# Altium schematic sheet DAC_AFE.SchDoc: DAC AFE
size 420 x 297 mm; Author: P. Zdunek; DrawnBy: P. Zdunek; Organization: WUT ISE; Address1: L3, 12a Rodborough Rd; Address2: Frenchs Forest; Address3: NSW; Address4: Australia 2086; DocumentNumber: 7; SheetNumber: 7; SheetTotal: 37; ModifiedBy: -; CheckedDate: -; Title2: Fast Stabilizer; DivGrp: WUT ISE; Designer: G.Kasprowicz
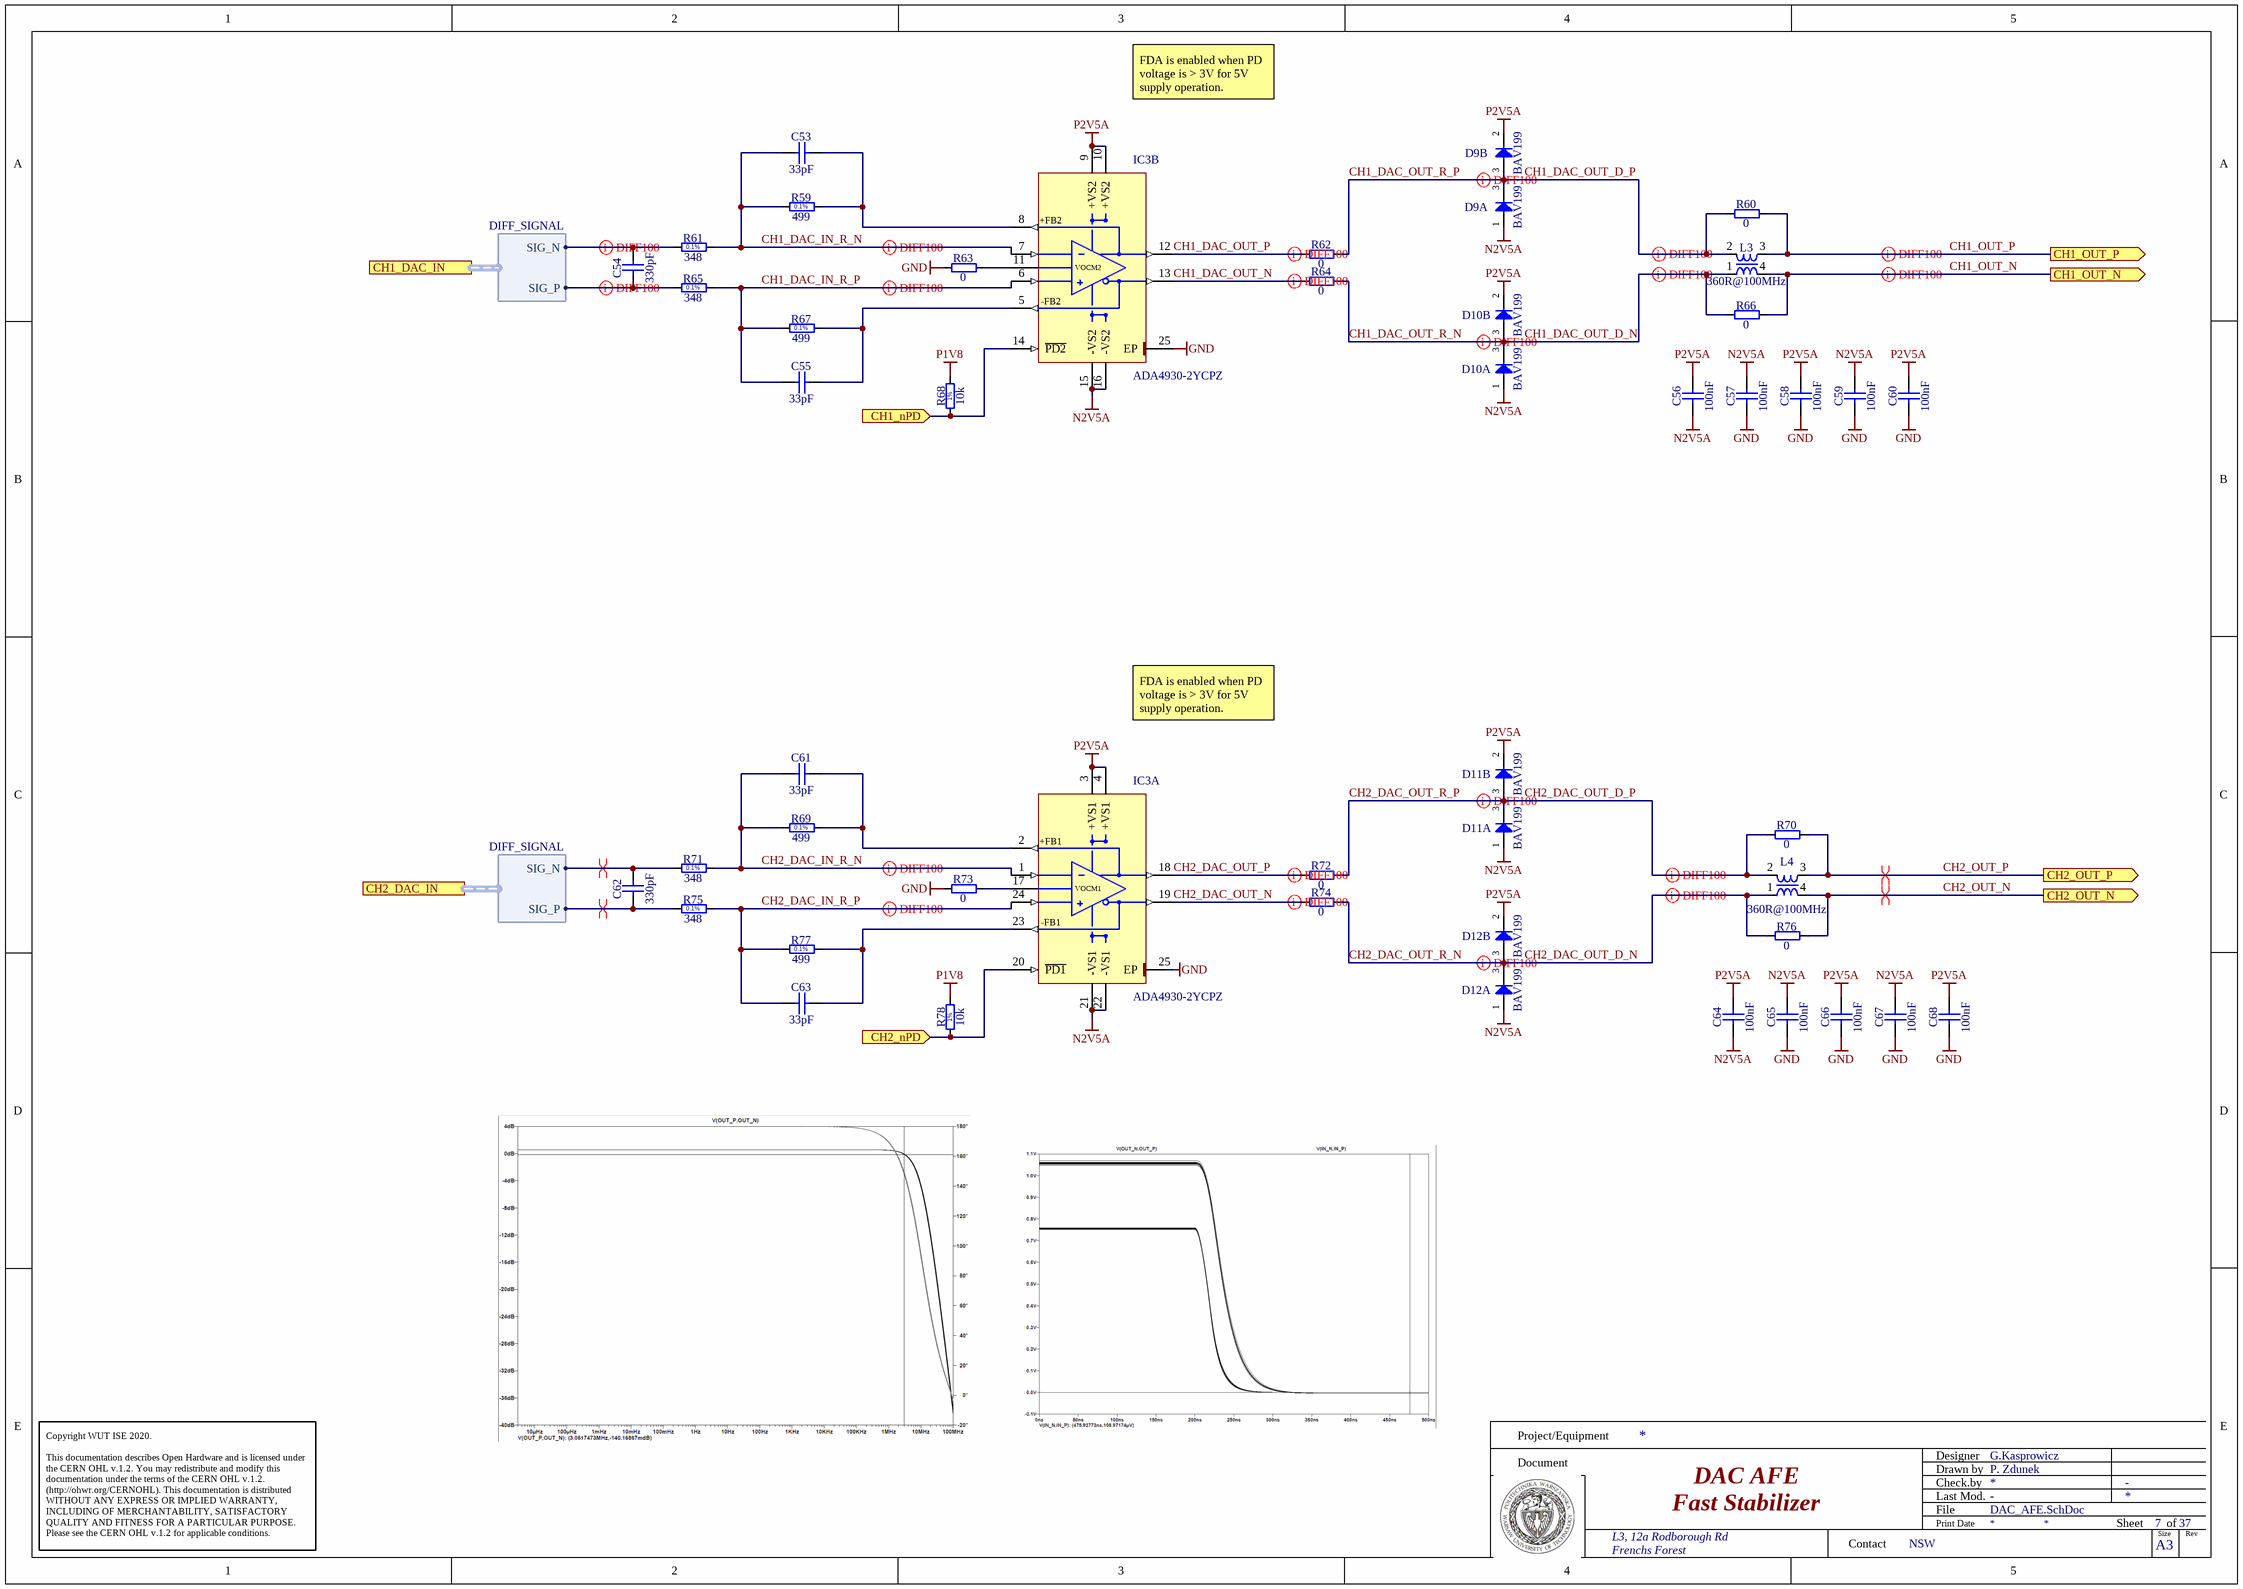
[diagram p0: DAC_AFE.SchDoc]

## Parts
C53  33pF  [CAPC1608X87N]
C54  330pF  [CAPC1608X87N]
C55  33pF  [CAPC1608X87N]
C56  100nF  [CAPC1005X55N]
C57  100nF  [CAPC1005X55N]
C58  100nF  [CAPC1005X55N]
C59  100nF  [CAPC1005X55N]
C60  100nF  [CAPC1005X55N]
C61  33pF  [CAPC1608X87N]
C62  330pF  [CAPC1608X87N]
C63  33pF  [CAPC1608X87N]
C64  100nF  [CAPC1005X55N]
C65  100nF  [CAPC1005X55N]
C66  100nF  [CAPC1005X55N]
C67  100nF  [CAPC1005X55N]
C68  100nF  [CAPC1005X55N]
D9  BAV199  [SOT95P240X110-3N]  (parts A,B of 2)
D10  BAV199  [SOT95P240X110-3N]  (parts A,B of 2)
D11  BAV199  [SOT95P240X110-3N]  (parts A,B of 2)
D12  BAV199  [SOT95P240X110-3N]  (parts A,B of 2)
IC3  ADA4930-2YCPZ  [QFN50P400X400X80-25N-S240]  (parts A,B of 2)
L3  360R@100MHz  [IND_TDK_ACM2012]
L4  360R@100MHz  [IND_TDK_ACM2012]
R59  499  [RESC1608X55N]
R60  0  [RESC1005X40N]
R61  348  [RESC1608X55N]
R62  0  [RESC1005X40N]
R63  0  [RESC1005X40N]
R64  0  [RESC1005X40N]
R65  348  [RESC1608X55N]
R66  0  [RESC1005X40N]
R67  499  [RESC1608X55N]
R68  10k  [RESC1005X40N]
R69  499  [RESC1608X55N]
R70  0  [RESC1005X40N]
R71  348  [RESC1608X55N]
R72  0  [RESC1005X40N]
R73  0  [RESC1005X40N]
R74  0  [RESC1005X40N]
R75  348  [RESC1608X55N]
R76  0  [RESC1005X40N]
R77  499  [RESC1608X55N]
R78  10k  [RESC1005X40N]

## Ports
CH1_DAC_IN (harness DIFF_SIGNAL), CH1_nPD (in), CH1_OUT_N (out), CH1_OUT_P (out), CH2_DAC_IN (harness DIFF_SIGNAL), CH2_nPD (in), CH2_OUT_N (out), CH2_OUT_P (out)

## Harnesses
DIFF_SIGNAL: SIG_N, SIG_P

## Nets
GND: C57.1 C58.1 C59.1 C60.1 C65.1 C66.1 C67.1 C68.1 IC3.25(EP) R63.1 R73.1
N2V5A: C56.1 C57.2 C59.2 C64.1 C65.2 C67.2 D9.1(A) D10.1(A) D11.1(A) D12.1(A) IC3.15(-VS2) IC3.16(-VS2) IC3.21(-VS1) IC3.22(-VS1)
P1V8: R68.2 R78.2
P2V5A: C56.2 C58.2 C60.2 C64.2 C66.2 C68.2 D9.2(C) D10.2(C) D11.2(C) D12.2(C) IC3.3(+VS1) IC3.4(+VS1) IC3.9(+VS2) IC3.10(+VS2)
CH1_DAC_IN_R_N: C53.1 IC3.7(-IN2) R59.1 R61.2
CH1_DAC_IN_R_P: C55.1 IC3.6(+IN2) R65.2 R67.1
CH1_DAC_OUT_D_N: D10.3(COMAC) L3.1 R64.2 R66.1  [also labelled CH1_DAC_OUT_R_N]
CH1_DAC_OUT_D_P: D9.3(COMAC) L3.2 R60.1 R62.2  [also labelled CH1_DAC_OUT_R_P]
CH1_DAC_OUT_N: IC3.13(-OUT2) R64.1
CH1_DAC_OUT_P: IC3.12(+OUT2) R62.1
CH1_nPD: IC3.14(~{PD2}) R68.1 ; port CH1_nPD
CH1_OUT_N: L3.4 R66.2 ; port CH1_OUT_N
CH1_OUT_P: L3.3 R60.2 ; port CH1_OUT_P
CH2_DAC_IN_R_N: C61.1 IC3.1(-IN1) R69.1 R71.2
CH2_DAC_IN_R_P: C63.1 IC3.24(+IN1) R75.2 R77.1
CH2_DAC_OUT_D_N: D12.3(COMAC) L4.1 R74.2 R76.1  [also labelled CH2_DAC_OUT_R_N]
CH2_DAC_OUT_D_P: D11.3(COMAC) L4.2 R70.1 R72.2  [also labelled CH2_DAC_OUT_R_P]
CH2_DAC_OUT_N: IC3.19(-OUT1) R74.1
CH2_DAC_OUT_P: IC3.18(+OUT1) R72.1
CH2_nPD: IC3.20(~{PD1}) R78.1 ; port CH2_nPD
CH2_OUT_N: L4.4 R76.2 ; port CH2_OUT_N
CH2_OUT_P: L4.3 R70.2 ; port CH2_OUT_P
NetC53_2: C53.2 IC3.8(+FB2) R59.2
NetC54_1: C54.1 R65.1 ; port CH1_DAC_IN.SIG_P
NetC54_2: C54.2 R61.1 ; port CH1_DAC_IN.SIG_N
NetC55_2: C55.2 IC3.5(-FB2) R67.2
NetC61_2: C61.2 IC3.2(+FB1) R69.2
NetC62_1: C62.1 R75.1 ; port CH2_DAC_IN.SIG_P
NetC62_2: C62.2 R71.1 ; port CH2_DAC_IN.SIG_N
NetC63_2: C63.2 IC3.23(-FB1) R77.2
NetIC3_11: IC3.11(VOCM2) R63.2
NetIC3_17: IC3.17(VOCM1) R73.2

## Layout directives
differential pair: CH1_DAC_IN_R_N, CH1_DAC_IN_R_P, CH1_DAC_OUT_D_N, CH1_DAC_OUT_D_P, CH1_DAC_OUT_N, CH1_DAC_OUT_P, CH1_OUT_N, CH1_OUT_P, CH2_DAC_IN_R_N, CH2_DAC_IN_R_P, CH2_DAC_OUT_D_N, CH2_DAC_OUT_D_P, CH2_DAC_OUT_N, CH2_DAC_OUT_P, CH2_OUT_N, CH2_OUT_P, NetC54_1, NetC54_2, NetC62_1, NetC62_2

## Notes on the sheet
- FDA is enabled when PD voltage is > 3V for 5V supply operation.
- Project/Equipment
- Document
- Designer
- Drawn by
- Check.by
- Copyright WUT ISE 2020.
  This documentation describes Open Hardware and is licensed under the CERN OHL v.1.2. You may redistribute and modify this documentation under the terms of the CERN OHL v.1.2. (http://ohwr.org/CERNOHL). This documentation is distributed WITHOUT ANY EXPRESS OR IMPLIED WARRANTY, INCLUDING OF MERCHANTABILITY, SATISFACTORY QUALITY AND FITNESS FOR A PARTICULAR PURPOSE. Please see the CERN OHL v.1.2 for applicable conditions.
- Contact
- File
- Last Mod.
- Print Date
- Sheet
- Size
- A3
- of
- Rev
- (in symbol R0402_10K_1%_0.0625W_100PPM) 1%
- (in symbol R0603_348R_0.1%_0.063W_10PPM) 0.1%
- (in symbol R0603_499R_0.1%_0.063W_10PPM) 0.1%

## Library data of the parts
C53 C55 C61 C63 = CC0603_33PF_50V_5%_NP0: Non-polarised capacitor; Part Description: SMD Multilayer Chip Ceramic Capacitor; Manufacturer: GENERIC; Manufacturer1 Part Number: 223886715339; Voltage: 50V; TC: C0G/NP0; Tolerance: ±5%; Part Number: CC0603_33PF_50V_5%_NP0; Component Kind: Standard; Component Type: Standard; Pin Count: 2; Value: 33pF; Status: Preferred; Manufacturer Part Number: CC0603_33PF_50V_5%_NP0; Case: 0603; Mounted: Yes; Socket: No; SMD: Yes; Sense: No; Manufacturer1 Example: PHYCOMP; Manufacturer1 ComponentHeight: 0.87mm; HelpURL: \\cern.ch\dfs\Applications\Altium\Datasheets\CC0603_NP0_PHYCOMP.pdf; Author: CERN DEM JLC; CreateDate: 03-Dec-07; LatestRevisionDate: 03-Dec-07
C54 C62 = CC0603_330PF_50V_1%_NP0: Non-polarised capacitor; Part Description: SMD Multilayer Chip Ceramic Capacitor; Manufacturer: GENERIC; Manufacturer1 Part Number: 223886718331; Voltage: 50V; TC: C0G/NP0; Tolerance: ±1%; Part Number: CC0603_330PF_50V_1%_NP0; Component Kind: Standard; Component Type: Standard; Pin Count: 2; Value: 330pF; Status: None; Manufacturer Part Number: CC0603_330PF_50V_1%_NP0; Case: 0603; Mounted: Yes; Socket: No; SMD: Yes; Sense: No; Manufacturer1 Example: PHYCOMP; Manufacturer1 ComponentHeight: 0.87mm; HelpURL: \\cern.ch\dfs\Applications\Altium\Datasheets\CC0603_NP0_PHYCOMP.pdf; Author: CERN DEM MR; CreateDate: 06.09.2017; LatestRevisionDate: 06.09.2017
C56-C60 C64-C68 = CC0402_100NF_16V_10%_X7R: Non-polarised capacitor; Part Description: SMD Multilayer Chip Ceramic Capacitor; Manufacturer: GENERIC; Manufacturer1 Part Number: GRM155R71C104KA88D; Voltage: 16V; TC: X7R; Tolerance: ±10%; Part Number: CC0402_100NF_16V_10%_X7R; Component Kind: Standard; Component Type: Standard; Pin Count: 2; Value: 100nF; Status: Not Recommended; Manufacturer Part Number: CC0402_100NF_16V_10%_X7R; Case: 0402; Mounted: Yes; Socket: No; SMD: Yes; Sense: No; Manufacturer1 Example: MURATA; Manufacturer1 ComponentHeight: 0.55mm; HelpURL: \\cern.ch\dfs\Applications\Altium\Datasheets\CC0402_X7R_MURATA_GRM.pdf; Author: CERN DEM JLC; CreateDate: 05-Dec-13; LatestRevisionDate: 03-Dec-07
D9-D12 = BAV199: Serial Diode; Part Description: Low-Leakage Double Diode; Manufacturer: NXP SEMICONDUCTORS; Voltage: 75V; Power: 250mW; PressFit: No; Bonding: No; Part Number: BAV199; Component Kind: Standard; Component Type: Standard; Device: BAV199; PackageDescription: SOT23 3-Leads, Pitch 0.95mm - Body 1.4x3mm, IPC Medium Density; Manufacturer Part Number: BAV199; Pin Count: 3; Case: SOT23-3; Mounted: Yes; Socket: No; SMD: Yes; Sense: No; ComponentHeight: 1.1mm; HelpURL: \\cern.ch\dfs\Applications\Altium\Datasheets\BAV199.pdf; Author: CERN DEM JMW; CreateDate: 2008-11-21; LatestRevisionDate: 2008-11-21
IC3 = ADA4930-2YCPZ: Ultralow Noise Drivers For Low Voltage ADCs; Manufacturer: ANALOG DEVICES; PressFit: No; Bonding: No; Part Number: ADA4930-2YCPZ; Component Kind: Standard; Component Type: Standard; Device: ADA4930-2YCPZ; PackageDescription: QFN, 0.50mm Pitch, Square; 24 Pin, 4.00mm L X 4.00mm W X 0.80mm H body (w/Thermal Tab 2.40 X 2.40mm), IPC Medium Density; Part Description: Ultralow Noise Drivers For Low Voltage ADCs; Manufacturer Part Number: ADA4930-2YCPZ; Pin Count: 25; Case: QFN24; Mounted: Yes; Socket: No; SMD: Yes; Sense: No; ComponentHeight: 0.8mm; Author: CERN DEM MR; HelpURL: \\cern.ch\dfs\Applications\Altium\Datasheets\ADA4930-2YCPZ.pdf; CreateDate: 23/11/2016; LatestRevisionDate: 23/11/2016
L3 L4 = IND_TDK_ACM2012-361-2P: Inductor Common Mode; Part Description: Common Mode Filters For High-Speed Differential Signal Line, TDK ACM2012 Series; Manufacturer: TDK; Power: 220mA; Resistance: 0R5; Part Number: IND_TDK_ACM2012-361-2P; Component Kind: Standard; Component Type: Standard; Pin Count: 2; Value: 360R@100MHz; Status: None; Manufacturer Part Number: ACM2012-361-2P; Mounted: Yes; Socket: No; SMD: Yes; Sense: No; ComponentHeight: 1.3mm; HelpURL: \\cern.ch\dfs\Applications\Altium\Datasheets\IND_TDK_ACM2012.pdf; Author: CERN DEM BC; CreateDate: 07/07/2020; LatestRevisionDate: 07/07/2020
R59 R67 R69 R77 = R0603_499R_0.1%_0.063W_10PPM: Resistor - 0.1%; Part Description: Thin Film Chip Resistor; Manufacturer: GENERIC; Manufacturer1 Part Number: RN73C1J499RBTDF; Power: 0.063W; TC: ±10ppm; PressFit: No; Part Number: R0603_499R_0.1%_0.063W_10PPM; Component Kind: Standard; Component Type: Standard; Pin Count: 2; Value: 499; Status: Not Recommended; Tolerance: ±0.1%; Manufacturer Part Number: R0603_499R_0.1%_0.063W_10PPM; Case: 0603; Mounted: Yes; Sense: No; Socket: No; SMD: Yes; Manufacturer1 Example: TYCO HOLSWORTHY; Manufacturer1 ComponentHeight: 0.5mm; HelpURL: \\cern.ch\dfs\Applications\Altium\Datasheets\R0603_Tyco_RN73.pdf; Author: CERN DEM JLC; CreateDate: 03-Dec-07; LatestRevisionDate: 13-Mar-08
R60 R62-R64 R66 R70 R72-R74 R76 = R0402_0R_JUMPER: Resistor; Part Description: 1A (0.05R Max DC Resistance) Zero Ohm Jumper; Manufacturer: GENERIC; Manufacturer1 Part Number: 232270591001L; PressFit: No; Part Number: R0402_0R_JUMPER; Component Kind: Standard; Component Type: Standard; Pin Count: 2; Value: 0; Status: Not Recommended; Manufacturer Part Number: R0402_0R_JUMPER; Case: 0402; Mounted: Yes; Sense: No; Socket: No; SMD: Yes; Manufacturer1 Example: YAGEO PHYCOMP; Manufacturer1 ComponentHeight: 0.4mm; HelpURL: \\cern.ch\dfs\Applications\Altium\Datasheets\R0402_Phycomp_RC0402.pdf; Author: CERN DEM JLC
  R60 R66 R70 R76: CreateDate: 03/12/2007; LatestRevisionDate: 17/10/2012
  R62-R64 R72-R74: CreateDate: 03-Dec-07; LatestRevisionDate: 17-Oct-12
R61 R65 R71 R75 = R0603_348R_0.1%_0.063W_10PPM: Resistor - 0.1%; Part Description: Thin Film Chip Resistor; Manufacturer: GENERIC; Manufacturer1 Part Number: RN73C1J348RBTDF; Power: 0.063W; TC: ±10ppm; PressFit: No; Part Number: R0603_348R_0.1%_0.063W_10PPM; Component Kind: Standard; Component Type: Standard; Pin Count: 2; Value: 348; Status: Not Recommended; Tolerance: ±0.1%; Manufacturer Part Number: R0603_348R_0.1%_0.063W_10PPM; Case: 0603; Mounted: Yes; Sense: No; Socket: No; SMD: Yes; Manufacturer1 Example: TYCO HOLSWORTHY; Manufacturer1 ComponentHeight: 0.5mm; HelpURL: \\cern.ch\dfs\Applications\Altium\Datasheets\R0603_Tyco_RN73.pdf; Author: CERN DEM JLC; CreateDate: 03-Dec-07; LatestRevisionDate: 13-Mar-08
R68 R78 = R0402_10K_1%_0.0625W_100PPM: Resistor - 1%; Part Description: General Purpose Thick Film Chip Resistor; Manufacturer: GENERIC; Manufacturer1 Part Number: 232270671003L; PressFit: No; TC: ±100ppm/°C; Part Number: R0402_10K_1%_0.0625W_100PPM; Component Kind: Standard; Component Type: Standard; Pin Count: 2; Value: 10k; Status: Not Recommended; Manufacturer Part Number: R0402_10K_1%_0.0625W_100PPM; Case: 0402; Mounted: Yes; Sense: No; Socket: No; SMD: Yes; Manufacturer1 Example: YAGEO PHYCOMP; Manufacturer1 ComponentHeight: 0.4mm; HelpURL: \\cern.ch\dfs\Applications\Altium\Datasheets\R0402_Phycomp_RC0402.pdf; Author: CERN DEM JLC; CreateDate: 03-Dec-07; LatestRevisionDate: 17-Oct-12; Power: 0.0625W; Tolerance: ±1%